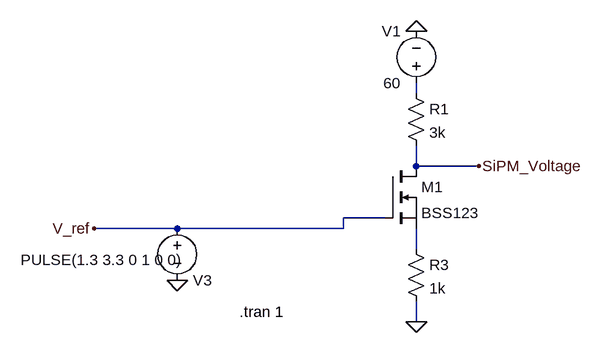
[diagram p0: schematic HVoltageControl.asc]
HVoltageControl.asc, the LTspice schematic file:
Version 4
SHEET 1 1232 680
WIRE 960 -32 960 -48
WIRE 960 80 960 48
WIRE 1056 80 960 80
WIRE 912 160 848 160
WIRE 592 176 464 176
WIRE 848 176 848 160
WIRE 848 176 592 176
WIRE 960 208 960 176
WIRE 960 320 960 288
FLAG 960 -128 0
FLAG 592 256 0
FLAG 960 320 0
FLAG 1056 80 SiPM_Voltage
FLAG 464 176 V_ref
SYMBOL nmos 912 80 R0
SYMATTR InstName M1
SYMATTR Value BSS123
SYMBOL voltage 960 -32 R180
WINDOW 0 24 96 Left 2
WINDOW 3 24 16 Left 2
WINDOW 123 0 0 Left 0
WINDOW 39 0 0 Left 0
SYMATTR InstName V1
SYMATTR Value 60
SYMBOL voltage 592 160 R0
WINDOW 0 24 96 Left 2
WINDOW 3 -241 64 Left 2
WINDOW 123 0 0 Left 0
WINDOW 39 0 0 Left 0
SYMATTR InstName V3
SYMATTR Value PULSE(1.3 3.3 0 1 0 0)
SYMBOL res 944 -48 R0
SYMATTR InstName R1
SYMATTR Value 3k
SYMBOL res 944 192 R0
SYMATTR InstName R3
SYMATTR Value 1k
TEXT 688 304 Left 2 !.tran 1

The netlist it stands for:
* HVoltageControl.asc
M1 SiPM_Voltage V_ref N002 N002 BSS123
V1 N001 0 60
V3 V_ref 0 PULSE(1.3 3.3 0 1 0 0)
R1 N001 SiPM_Voltage 3k
R3 N002 0 1k
.model NMOS NMOS
.model PMOS PMOS
.lib standard.mos
.tran 1
.backanno
.end